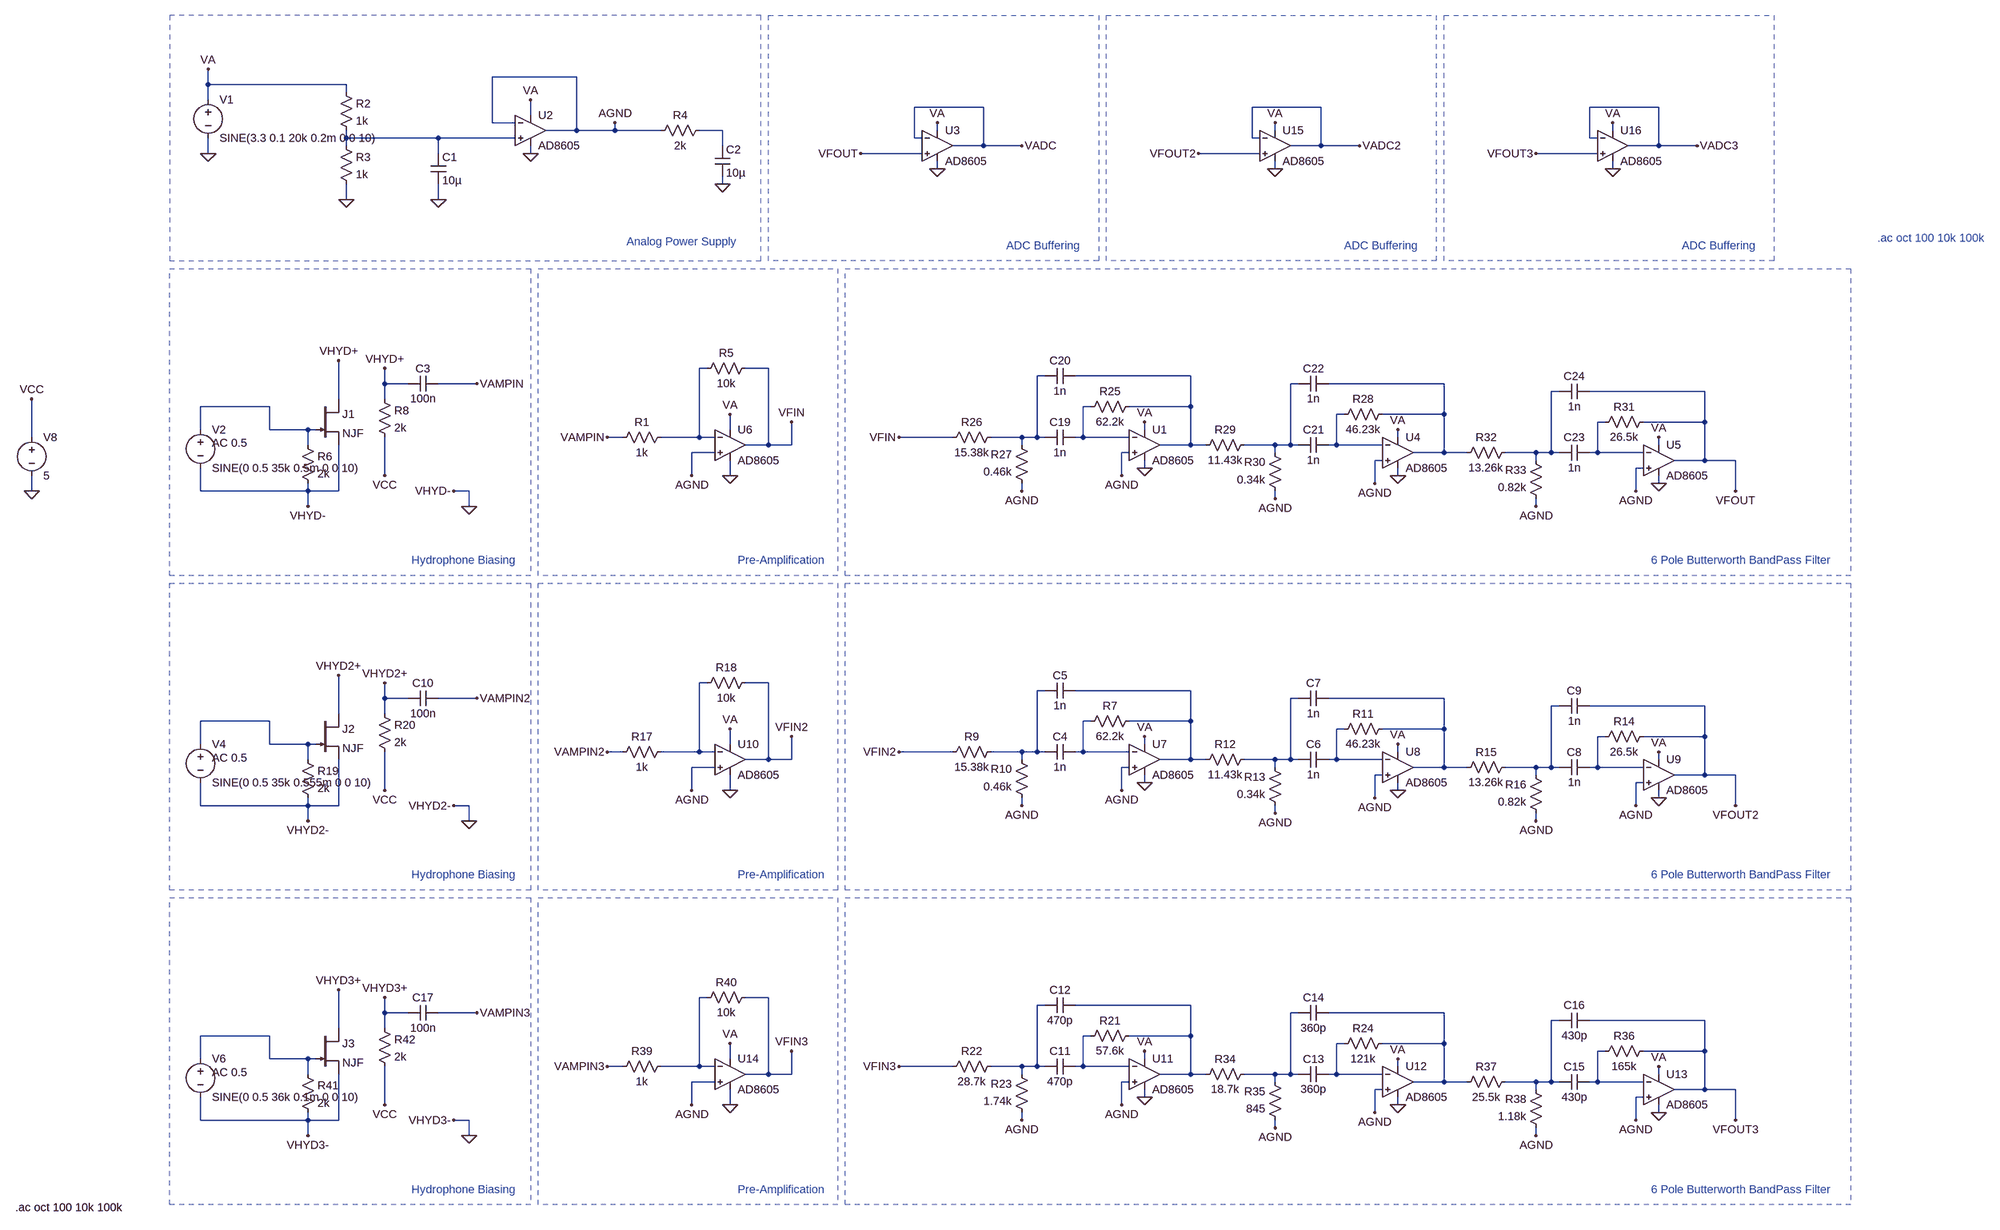
[diagram p0: schematic APB_Filter.asc]
APB_Filter.asc, the LTspice schematic file:
Version 4
SHEET 1 5168 1480
WIRE -528 -896 -704 -896
WIRE -1296 -880 -1296 -912
WIRE -1008 -880 -1296 -880
WIRE -1008 -864 -1008 -880
WIRE -1296 -848 -1296 -880
WIRE 320 -832 176 -832
WIRE 1024 -832 880 -832
WIRE 1728 -832 1584 -832
WIRE -624 -816 -624 -848
WIRE -704 -800 -704 -896
WIRE -656 -800 -704 -800
WIRE -528 -784 -528 -896
WIRE -528 -784 -592 -784
WIRE -448 -784 -448 -800
WIRE -448 -784 -528 -784
WIRE -352 -784 -448 -784
WIRE -224 -784 -272 -784
WIRE 224 -784 224 -800
WIRE 928 -784 928 -800
WIRE 1632 -784 1632 -800
WIRE -1008 -768 -1008 -784
WIRE -816 -768 -1008 -768
WIRE -656 -768 -816 -768
WIRE 176 -768 176 -832
WIRE 192 -768 176 -768
WIRE 880 -768 880 -832
WIRE 896 -768 880 -768
WIRE 1584 -768 1584 -832
WIRE 1600 -768 1584 -768
WIRE -1008 -752 -1008 -768
WIRE -224 -752 -224 -784
WIRE 320 -752 320 -832
WIRE 320 -752 256 -752
WIRE 400 -752 320 -752
WIRE 1024 -752 1024 -832
WIRE 1024 -752 960 -752
WIRE 1104 -752 1024 -752
WIRE 1728 -752 1728 -832
WIRE 1728 -752 1664 -752
WIRE 1808 -752 1728 -752
WIRE -1296 -736 -1296 -768
WIRE -816 -736 -816 -768
WIRE -624 -736 -624 -752
WIRE 192 -736 64 -736
WIRE 896 -736 768 -736
WIRE 1600 -736 1472 -736
WIRE 224 -704 224 -720
WIRE 928 -704 928 -720
WIRE 1632 -704 1632 -720
WIRE -224 -672 -224 -688
WIRE -1008 -640 -1008 -672
WIRE -816 -640 -816 -672
WIRE -256 -288 -272 -288
WIRE -128 -288 -176 -288
WIRE 448 -272 432 -272
WIRE 752 -272 512 -272
WIRE -928 -256 -928 -288
WIRE -880 -256 -928 -256
WIRE -736 -256 -816 -256
WIRE 976 -256 960 -256
WIRE 1280 -256 1040 -256
WIRE 1520 -240 1504 -240
WIRE 1824 -240 1584 -240
WIRE -1024 -224 -1024 -304
WIRE -928 -224 -928 -256
WIRE -1168 -208 -1312 -208
WIRE 544 -208 528 -208
WIRE 752 -208 752 -272
WIRE 752 -208 624 -208
WIRE 1072 -192 1056 -192
WIRE 1280 -192 1280 -256
WIRE 1280 -192 1152 -192
WIRE 1616 -176 1600 -176
WIRE 1824 -176 1824 -240
WIRE 1824 -176 1696 -176
WIRE -1312 -160 -1312 -208
WIRE -1168 -160 -1168 -208
WIRE -1088 -160 -1168 -160
WIRE -1072 -160 -1088 -160
WIRE -208 -160 -208 -192
WIRE 656 -160 656 -176
WIRE -1664 -144 -1664 -224
WIRE -432 -144 -464 -144
WIRE -272 -144 -272 -288
WIRE -272 -144 -352 -144
WIRE -240 -144 -272 -144
WIRE 256 -144 144 -144
WIRE 400 -144 336 -144
WIRE 432 -144 432 -272
WIRE 432 -144 400 -144
WIRE 448 -144 432 -144
WIRE 528 -144 528 -208
WIRE 528 -144 512 -144
WIRE 624 -144 528 -144
WIRE 1184 -144 1184 -160
WIRE -1088 -128 -1088 -160
WIRE -128 -128 -128 -288
WIRE -128 -128 -176 -128
WIRE -80 -128 -80 -176
WIRE -80 -128 -128 -128
WIRE 400 -128 400 -144
WIRE 752 -128 752 -208
WIRE 752 -128 688 -128
WIRE 784 -128 752 -128
WIRE 928 -128 864 -128
WIRE 960 -128 960 -256
WIRE 960 -128 928 -128
WIRE 976 -128 960 -128
WIRE 1056 -128 1056 -192
WIRE 1056 -128 1040 -128
WIRE 1152 -128 1056 -128
WIRE 1728 -128 1728 -144
WIRE -240 -112 -288 -112
WIRE 624 -112 608 -112
WIRE 928 -112 928 -128
WIRE 1280 -112 1280 -192
WIRE 1280 -112 1216 -112
WIRE 1328 -112 1280 -112
WIRE 1472 -112 1408 -112
WIRE 1504 -112 1504 -240
WIRE 1504 -112 1472 -112
WIRE 1520 -112 1504 -112
WIRE 1600 -112 1600 -176
WIRE 1600 -112 1584 -112
WIRE 1696 -112 1600 -112
WIRE 1152 -96 1136 -96
WIRE 1472 -96 1472 -112
WIRE 1824 -96 1824 -176
WIRE 1824 -96 1760 -96
WIRE 1888 -96 1824 -96
WIRE 656 -80 656 -96
WIRE 1696 -80 1680 -80
WIRE -928 -64 -928 -144
WIRE -288 -64 -288 -112
WIRE -208 -64 -208 -96
WIRE 608 -64 608 -112
WIRE 1184 -64 1184 -80
WIRE 1136 -48 1136 -96
WIRE 1728 -48 1728 -64
WIRE -1664 -32 -1664 -64
WIRE -1312 -32 -1312 -80
WIRE -1088 -32 -1088 -48
WIRE -1088 -32 -1312 -32
WIRE -1024 -32 -1024 -128
WIRE -1024 -32 -1088 -32
WIRE -752 -32 -784 -32
WIRE 400 -32 400 -48
WIRE 1680 -32 1680 -80
WIRE 1888 -32 1888 -96
WIRE 928 -16 928 -32
WIRE -1088 0 -1088 -32
WIRE -752 0 -752 -32
WIRE 1472 0 1472 -16
WIRE -256 368 -272 368
WIRE -128 368 -176 368
WIRE 448 384 432 384
WIRE 752 384 512 384
WIRE -928 400 -928 368
WIRE -880 400 -928 400
WIRE -736 400 -816 400
WIRE 976 400 960 400
WIRE 1280 400 1040 400
WIRE 1520 416 1504 416
WIRE 1824 416 1584 416
WIRE -1024 432 -1024 352
WIRE -928 432 -928 400
WIRE -1168 448 -1312 448
WIRE 544 448 528 448
WIRE 752 448 752 384
WIRE 752 448 624 448
WIRE 1072 464 1056 464
WIRE 1280 464 1280 400
WIRE 1280 464 1152 464
WIRE 1616 480 1600 480
WIRE 1824 480 1824 416
WIRE 1824 480 1696 480
WIRE -1312 496 -1312 448
WIRE -1168 496 -1168 448
WIRE -1088 496 -1168 496
WIRE -1072 496 -1088 496
WIRE -208 496 -208 464
WIRE 656 496 656 480
WIRE -432 512 -464 512
WIRE -272 512 -272 368
WIRE -272 512 -352 512
WIRE -240 512 -272 512
WIRE 256 512 144 512
WIRE 400 512 336 512
WIRE 432 512 432 384
WIRE 432 512 400 512
WIRE 448 512 432 512
WIRE 528 512 528 448
WIRE 528 512 512 512
WIRE 624 512 528 512
WIRE 1184 512 1184 496
WIRE -1088 528 -1088 496
WIRE -128 528 -128 368
WIRE -128 528 -176 528
WIRE -80 528 -80 480
WIRE -80 528 -128 528
WIRE 400 528 400 512
WIRE 752 528 752 448
WIRE 752 528 688 528
WIRE 784 528 752 528
WIRE 928 528 864 528
WIRE 960 528 960 400
WIRE 960 528 928 528
WIRE 976 528 960 528
WIRE 1056 528 1056 464
WIRE 1056 528 1040 528
WIRE 1152 528 1056 528
WIRE 1728 528 1728 512
WIRE -240 544 -288 544
WIRE 624 544 608 544
WIRE 928 544 928 528
WIRE 1280 544 1280 464
WIRE 1280 544 1216 544
WIRE 1328 544 1280 544
WIRE 1472 544 1408 544
WIRE 1504 544 1504 416
WIRE 1504 544 1472 544
WIRE 1520 544 1504 544
WIRE 1600 544 1600 480
WIRE 1600 544 1584 544
WIRE 1696 544 1600 544
WIRE 1152 560 1136 560
WIRE 1472 560 1472 544
WIRE 1824 560 1824 480
WIRE 1824 560 1760 560
WIRE 1888 560 1824 560
WIRE 656 576 656 560
WIRE 1696 576 1680 576
WIRE -928 592 -928 512
WIRE -288 592 -288 544
WIRE -208 592 -208 560
WIRE 608 592 608 544
WIRE 1184 592 1184 576
WIRE 1136 608 1136 560
WIRE 1728 608 1728 592
WIRE -1312 624 -1312 576
WIRE -1088 624 -1088 608
WIRE -1088 624 -1312 624
WIRE -1024 624 -1024 528
WIRE -1024 624 -1088 624
WIRE -752 624 -784 624
WIRE 400 624 400 608
WIRE 1680 624 1680 576
WIRE 1888 624 1888 560
WIRE 928 640 928 624
WIRE -1088 656 -1088 624
WIRE -752 656 -752 624
WIRE 1472 656 1472 640
WIRE -256 1024 -272 1024
WIRE -128 1024 -176 1024
WIRE 448 1040 432 1040
WIRE 752 1040 512 1040
WIRE -928 1056 -928 1024
WIRE -880 1056 -928 1056
WIRE -736 1056 -816 1056
WIRE 976 1056 960 1056
WIRE 1280 1056 1040 1056
WIRE 1520 1072 1504 1072
WIRE 1824 1072 1584 1072
WIRE -1024 1088 -1024 1008
WIRE -928 1088 -928 1056
WIRE -1168 1104 -1312 1104
WIRE 544 1104 528 1104
WIRE 752 1104 752 1040
WIRE 752 1104 624 1104
WIRE 1072 1120 1056 1120
WIRE 1280 1120 1280 1056
WIRE 1280 1120 1152 1120
WIRE 1616 1136 1600 1136
WIRE 1824 1136 1824 1072
WIRE 1824 1136 1696 1136
WIRE -1312 1152 -1312 1104
WIRE -1168 1152 -1168 1104
WIRE -1088 1152 -1168 1152
WIRE -1072 1152 -1088 1152
WIRE -208 1152 -208 1120
WIRE 656 1152 656 1136
WIRE -432 1168 -464 1168
WIRE -272 1168 -272 1024
WIRE -272 1168 -352 1168
WIRE -240 1168 -272 1168
WIRE 256 1168 144 1168
WIRE 400 1168 336 1168
WIRE 432 1168 432 1040
WIRE 432 1168 400 1168
WIRE 448 1168 432 1168
WIRE 528 1168 528 1104
WIRE 528 1168 512 1168
WIRE 624 1168 528 1168
WIRE 1184 1168 1184 1152
WIRE -1088 1184 -1088 1152
WIRE -128 1184 -128 1024
WIRE -128 1184 -176 1184
WIRE -80 1184 -80 1136
WIRE -80 1184 -128 1184
WIRE 400 1184 400 1168
WIRE 752 1184 752 1104
WIRE 752 1184 688 1184
WIRE 784 1184 752 1184
WIRE 928 1184 864 1184
WIRE 960 1184 960 1056
WIRE 960 1184 928 1184
WIRE 976 1184 960 1184
WIRE 1056 1184 1056 1120
WIRE 1056 1184 1040 1184
WIRE 1152 1184 1056 1184
WIRE 1728 1184 1728 1168
WIRE -240 1200 -288 1200
WIRE 624 1200 608 1200
WIRE 928 1200 928 1184
WIRE 1280 1200 1280 1120
WIRE 1280 1200 1216 1200
WIRE 1328 1200 1280 1200
WIRE 1472 1200 1408 1200
WIRE 1504 1200 1504 1072
WIRE 1504 1200 1472 1200
WIRE 1520 1200 1504 1200
WIRE 1600 1200 1600 1136
WIRE 1600 1200 1584 1200
WIRE 1696 1200 1600 1200
WIRE 1152 1216 1136 1216
WIRE 1472 1216 1472 1200
WIRE 1824 1216 1824 1136
WIRE 1824 1216 1760 1216
WIRE 1888 1216 1824 1216
WIRE 656 1232 656 1216
WIRE 1696 1232 1680 1232
WIRE -928 1248 -928 1168
WIRE -288 1248 -288 1200
WIRE -208 1248 -208 1216
WIRE 608 1248 608 1200
WIRE 1184 1248 1184 1232
WIRE 1136 1264 1136 1216
WIRE 1728 1264 1728 1248
WIRE -1312 1280 -1312 1232
WIRE -1088 1280 -1088 1264
WIRE -1088 1280 -1312 1280
WIRE -1024 1280 -1024 1184
WIRE -1024 1280 -1088 1280
WIRE -752 1280 -784 1280
WIRE 400 1280 400 1264
WIRE 1680 1280 1680 1232
WIRE 1888 1280 1888 1216
WIRE 928 1296 928 1280
WIRE -1088 1312 -1088 1280
WIRE -752 1312 -752 1280
WIRE 1472 1312 1472 1296
FLAG -1296 -912 VA
FLAG -1008 -640 0
FLAG -448 -800 AGND
FLAG -224 -672 0
FLAG 608 -64 AGND
FLAG 656 -80 0
FLAG 656 -176 VA
FLAG 400 -32 AGND
FLAG 1136 -48 AGND
FLAG 1184 -64 0
FLAG 1184 -160 VA
FLAG 928 -16 AGND
FLAG 1680 -32 AGND
FLAG 1728 -48 0
FLAG 1728 -144 VA
FLAG 1472 0 AGND
FLAG 144 -144 VFIN
FLAG 224 -704 0
FLAG 224 -800 VA
FLAG -208 -192 VA
FLAG -208 -64 0
FLAG -288 -64 AGND
FLAG -464 -144 VAMPIN
FLAG -80 -176 VFIN
FLAG 64 -736 VFOUT
FLAG 400 -752 VADC
FLAG 1888 -32 VFOUT
FLAG -1296 -736 0
FLAG -624 -736 0
FLAG -624 -848 VA
FLAG -816 -640 0
FLAG -1088 0 VHYD-
FLAG -1024 -304 VHYD+
FLAG -752 0 0
FLAG -784 -32 VHYD-
FLAG -928 -288 VHYD+
FLAG -736 -256 VAMPIN
FLAG 608 592 AGND
FLAG 656 576 0
FLAG 656 480 VA
FLAG 400 624 AGND
FLAG 1136 608 AGND
FLAG 1184 592 0
FLAG 1184 496 VA
FLAG 928 640 AGND
FLAG 1680 624 AGND
FLAG 1728 608 0
FLAG 1728 512 VA
FLAG 1472 656 AGND
FLAG 144 512 VFIN2
FLAG -208 464 VA
FLAG -208 592 0
FLAG -288 592 AGND
FLAG -464 512 VAMPIN2
FLAG -80 480 VFIN2
FLAG 1888 624 VFOUT2
FLAG -1088 656 VHYD2-
FLAG -1024 352 VHYD2+
FLAG -752 656 0
FLAG -784 624 VHYD2-
FLAG -928 368 VHYD2+
FLAG -736 400 VAMPIN2
FLAG 608 1248 AGND
FLAG 656 1232 0
FLAG 656 1136 VA
FLAG 400 1280 AGND
FLAG 1136 1264 AGND
FLAG 1184 1248 0
FLAG 1184 1152 VA
FLAG 928 1296 AGND
FLAG 1680 1280 AGND
FLAG 1728 1264 0
FLAG 1728 1168 VA
FLAG 1472 1312 AGND
FLAG 144 1168 VFIN3
FLAG -208 1120 VA
FLAG -208 1248 0
FLAG -288 1248 AGND
FLAG -464 1168 VAMPIN3
FLAG -80 1136 VFIN3
FLAG 1888 1280 VFOUT3
FLAG -1088 1312 VHYD3-
FLAG -1024 1008 VHYD3+
FLAG -752 1312 0
FLAG -784 1280 VHYD3-
FLAG -928 1024 VHYD3+
FLAG -736 1056 VAMPIN3
FLAG -1664 -32 0
FLAG -1664 -224 VCC
FLAG -928 -64 VCC
FLAG -928 592 VCC
FLAG -928 1248 VCC
FLAG 928 -704 0
FLAG 928 -800 VA
FLAG 768 -736 VFOUT2
FLAG 1104 -752 VADC2
FLAG 1632 -704 0
FLAG 1632 -800 VA
FLAG 1472 -736 VFOUT3
FLAG 1808 -752 VADC3
SYMBOL res -1024 -880 R0
SYMATTR InstName R2
SYMATTR Value 1k
SYMBOL res -1024 -768 R0
SYMATTR InstName R3
SYMATTR Value 1k
SYMBOL cap -832 -736 R0
SYMATTR InstName C1
SYMATTR Value 10µ
SYMBOL res -256 -800 R90
WINDOW 0 0 56 VBottom 2
WINDOW 3 32 56 VTop 2
SYMATTR InstName R4
SYMATTR Value 2k
SYMBOL cap -240 -752 R0
SYMATTR InstName C2
SYMATTR Value 10µ
SYMBOL cap 512 -160 R90
WINDOW 0 0 32 VBottom 2
WINDOW 3 32 32 VTop 2
SYMATTR InstName C19
SYMATTR Value 1n
SYMBOL cap 512 -288 R90
WINDOW 0 0 32 VBottom 2
WINDOW 3 32 32 VTop 2
SYMATTR InstName C20
SYMATTR Value 1n
SYMBOL res 640 -224 R90
WINDOW 0 0 56 VBottom 2
WINDOW 3 32 56 VTop 2
SYMATTR InstName R25
SYMATTR Value 62.2k
SYMBOL res 352 -160 R90
WINDOW 0 0 56 VBottom 2
WINDOW 3 32 56 VTop 2
SYMATTR InstName R26
SYMATTR Value 15.38k
SYMBOL res 416 -32 R180
WINDOW 0 36 76 Left 2
WINDOW 3 36 40 Left 2
SYMATTR InstName R27
SYMATTR Value 0.46k
SYMBOL cap 1040 -144 R90
WINDOW 0 0 32 VBottom 2
WINDOW 3 32 32 VTop 2
SYMATTR InstName C21
SYMATTR Value 1n
SYMBOL cap 1040 -272 R90
WINDOW 0 0 32 VBottom 2
WINDOW 3 32 32 VTop 2
SYMATTR InstName C22
SYMATTR Value 1n
SYMBOL res 1168 -208 R90
WINDOW 0 0 56 VBottom 2
WINDOW 3 32 56 VTop 2
SYMATTR InstName R28
SYMATTR Value 46.23k
SYMBOL res 880 -144 R90
WINDOW 0 0 56 VBottom 2
WINDOW 3 32 56 VTop 2
SYMATTR InstName R29
SYMATTR Value 11.43k
SYMBOL res 944 -16 R180
WINDOW 0 36 76 Left 2
WINDOW 3 36 40 Left 2
SYMATTR InstName R30
SYMATTR Value 0.34k
SYMBOL cap 1584 -128 R90
WINDOW 0 0 32 VBottom 2
WINDOW 3 32 32 VTop 2
SYMATTR InstName C23
SYMATTR Value 1n
SYMBOL cap 1584 -256 R90
WINDOW 0 0 32 VBottom 2
WINDOW 3 32 32 VTop 2
SYMATTR InstName C24
SYMATTR Value 1n
SYMBOL res 1712 -192 R90
WINDOW 0 0 56 VBottom 2
WINDOW 3 32 56 VTop 2
SYMATTR InstName R31
SYMATTR Value 26.5k
SYMBOL res 1424 -128 R90
WINDOW 0 0 56 VBottom 2
WINDOW 3 32 56 VTop 2
SYMATTR InstName R32
SYMATTR Value 13.26k
SYMBOL res 1488 0 R180
WINDOW 0 36 76 Left 2
WINDOW 3 36 40 Left 2
SYMATTR InstName R33
SYMATTR Value 0.82k
SYMBOL res -336 -160 R90
WINDOW 0 0 56 VBottom 2
WINDOW 3 32 56 VTop 2
SYMATTR InstName R1
SYMATTR Value 1k
SYMBOL res -160 -304 R90
WINDOW 0 0 56 VBottom 2
WINDOW 3 32 56 VTop 2
SYMATTR InstName R5
SYMATTR Value 10k
SYMBOL voltage -1296 -864 R0
WINDOW 123 0 0 Left 0
WINDOW 39 0 0 Left 0
SYMATTR InstName V1
SYMATTR Value SINE(3.3 0.1 20k 0.2m 0 0 10)
SYMBOL voltage -1312 -176 R0
WINDOW 123 24 44 Left 2
WINDOW 39 0 0 Left 0
SYMATTR Value2 AC 0.5
SYMATTR InstName V2
SYMATTR Value SINE(0 0.5 35k 0.5m 0 0 10)
SYMBOL res -1104 -144 R0
SYMATTR InstName R6
SYMATTR Value 2k
SYMBOL njf -1072 -224 R0
SYMATTR InstName J1
SYMBOL res -944 -240 R0
SYMATTR InstName R8
SYMATTR Value 2k
SYMBOL cap -816 -272 R90
WINDOW 0 0 32 VBottom 2
WINDOW 3 32 32 VTop 2
SYMATTR InstName C3
SYMATTR Value 100n
SYMBOL OpAmps\\AD8605 656 -192 R0
SYMATTR InstName U1
SYMBOL OpAmps\\AD8605 1184 -176 R0
SYMATTR InstName U4
SYMBOL OpAmps\\AD8605 1728 -160 R0
SYMATTR InstName U5
SYMBOL OpAmps\\AD8605 -624 -848 R0
SYMATTR InstName U2
SYMBOL OpAmps\\AD8605 224 -816 R0
SYMATTR InstName U3
SYMBOL OpAmps\\AD8605 -208 -192 R0
SYMATTR InstName U6
SYMBOL cap 512 496 R90
WINDOW 0 0 32 VBottom 2
WINDOW 3 32 32 VTop 2
SYMATTR InstName C4
SYMATTR Value 1n
SYMBOL cap 512 368 R90
WINDOW 0 0 32 VBottom 2
WINDOW 3 32 32 VTop 2
SYMATTR InstName C5
SYMATTR Value 1n
SYMBOL res 640 432 R90
WINDOW 0 0 56 VBottom 2
WINDOW 3 32 56 VTop 2
SYMATTR InstName R7
SYMATTR Value 62.2k
SYMBOL res 352 496 R90
WINDOW 0 0 56 VBottom 2
WINDOW 3 32 56 VTop 2
SYMATTR InstName R9
SYMATTR Value 15.38k
SYMBOL res 416 624 R180
WINDOW 0 36 76 Left 2
WINDOW 3 36 40 Left 2
SYMATTR InstName R10
SYMATTR Value 0.46k
SYMBOL cap 1040 512 R90
WINDOW 0 0 32 VBottom 2
WINDOW 3 32 32 VTop 2
SYMATTR InstName C6
SYMATTR Value 1n
SYMBOL cap 1040 384 R90
WINDOW 0 0 32 VBottom 2
WINDOW 3 32 32 VTop 2
SYMATTR InstName C7
SYMATTR Value 1n
SYMBOL res 1168 448 R90
WINDOW 0 0 56 VBottom 2
WINDOW 3 32 56 VTop 2
SYMATTR InstName R11
SYMATTR Value 46.23k
SYMBOL res 880 512 R90
WINDOW 0 0 56 VBottom 2
WINDOW 3 32 56 VTop 2
SYMATTR InstName R12
SYMATTR Value 11.43k
SYMBOL res 944 640 R180
WINDOW 0 36 76 Left 2
WINDOW 3 36 40 Left 2
SYMATTR InstName R13
SYMATTR Value 0.34k
SYMBOL cap 1584 528 R90
WINDOW 0 0 32 VBottom 2
WINDOW 3 32 32 VTop 2
SYMATTR InstName C8
SYMATTR Value 1n
SYMBOL cap 1584 400 R90
WINDOW 0 0 32 VBottom 2
WINDOW 3 32 32 VTop 2
SYMATTR InstName C9
SYMATTR Value 1n
SYMBOL res 1712 464 R90
WINDOW 0 0 56 VBottom 2
WINDOW 3 32 56 VTop 2
SYMATTR InstName R14
SYMATTR Value 26.5k
SYMBOL res 1424 528 R90
WINDOW 0 0 56 VBottom 2
WINDOW 3 32 56 VTop 2
SYMATTR InstName R15
SYMATTR Value 13.26k
SYMBOL res 1488 656 R180
WINDOW 0 36 76 Left 2
WINDOW 3 36 40 Left 2
SYMATTR InstName R16
SYMATTR Value 0.82k
SYMBOL res -336 496 R90
WINDOW 0 0 56 VBottom 2
WINDOW 3 32 56 VTop 2
SYMATTR InstName R17
SYMATTR Value 1k
SYMBOL res -160 352 R90
WINDOW 0 0 56 VBottom 2
WINDOW 3 32 56 VTop 2
SYMATTR InstName R18
SYMATTR Value 10k
SYMBOL voltage -1312 480 R0
WINDOW 123 24 44 Left 2
WINDOW 39 0 0 Left 0
SYMATTR Value2 AC 0.5
SYMATTR InstName V4
SYMATTR Value SINE(0 0.5 35k 0.555m 0 0 10)
SYMBOL res -1104 512 R0
SYMATTR InstName R19
SYMATTR Value 2k
SYMBOL njf -1072 432 R0
SYMATTR InstName J2
SYMBOL res -944 416 R0
SYMATTR InstName R20
SYMATTR Value 2k
SYMBOL cap -816 384 R90
WINDOW 0 0 32 VBottom 2
WINDOW 3 32 32 VTop 2
SYMATTR InstName C10
SYMATTR Value 100n
SYMBOL OpAmps\\AD8605 656 464 R0
SYMATTR InstName U7
SYMBOL OpAmps\\AD8605 1184 480 R0
SYMATTR InstName U8
SYMBOL OpAmps\\AD8605 1728 496 R0
SYMATTR InstName U9
SYMBOL OpAmps\\AD8605 -208 464 R0
SYMATTR InstName U10
SYMBOL cap 512 1152 R90
WINDOW 0 0 32 VBottom 2
WINDOW 3 32 32 VTop 2
SYMATTR InstName C11
SYMATTR Value 470p
SYMBOL cap 512 1024 R90
WINDOW 0 0 32 VBottom 2
WINDOW 3 32 32 VTop 2
SYMATTR InstName C12
SYMATTR Value 470p
SYMBOL res 640 1088 R90
WINDOW 0 0 56 VBottom 2
WINDOW 3 32 56 VTop 2
SYMATTR InstName R21
SYMATTR Value 57.6k
SYMBOL res 352 1152 R90
WINDOW 0 0 56 VBottom 2
WINDOW 3 32 56 VTop 2
SYMATTR InstName R22
SYMATTR Value 28.7k
SYMBOL res 416 1280 R180
WINDOW 0 36 76 Left 2
WINDOW 3 36 40 Left 2
SYMATTR InstName R23
SYMATTR Value 1.74k
SYMBOL cap 1040 1168 R90
WINDOW 0 0 32 VBottom 2
WINDOW 3 32 32 VTop 2
SYMATTR InstName C13
SYMATTR Value 360p
SYMBOL cap 1040 1040 R90
WINDOW 0 0 32 VBottom 2
WINDOW 3 32 32 VTop 2
SYMATTR InstName C14
SYMATTR Value 360p
SYMBOL res 1168 1104 R90
WINDOW 0 0 56 VBottom 2
WINDOW 3 32 56 VTop 2
SYMATTR InstName R24
SYMATTR Value 121k
SYMBOL res 880 1168 R90
WINDOW 0 0 56 VBottom 2
WINDOW 3 32 56 VTop 2
SYMATTR InstName R34
SYMATTR Value 18.7k
SYMBOL res 944 1296 R180
WINDOW 0 36 76 Left 2
WINDOW 3 36 40 Left 2
SYMATTR InstName R35
SYMATTR Value 845
SYMBOL cap 1584 1184 R90
WINDOW 0 0 32 VBottom 2
WINDOW 3 32 32 VTop 2
SYMATTR InstName C15
SYMATTR Value 430p
SYMBOL cap 1584 1056 R90
WINDOW 0 0 32 VBottom 2
WINDOW 3 32 32 VTop 2
SYMATTR InstName C16
SYMATTR Value 430p
SYMBOL res 1712 1120 R90
WINDOW 0 0 56 VBottom 2
WINDOW 3 32 56 VTop 2
SYMATTR InstName R36
SYMATTR Value 165k
SYMBOL res 1424 1184 R90
WINDOW 0 0 56 VBottom 2
WINDOW 3 32 56 VTop 2
SYMATTR InstName R37
SYMATTR Value 25.5k
SYMBOL res 1488 1312 R180
WINDOW 0 36 76 Left 2
WINDOW 3 36 40 Left 2
SYMATTR InstName R38
SYMATTR Value 1.18k
SYMBOL res -336 1152 R90
WINDOW 0 0 56 VBottom 2
WINDOW 3 32 56 VTop 2
SYMATTR InstName R39
SYMATTR Value 1k
SYMBOL res -160 1008 R90
WINDOW 0 0 56 VBottom 2
WINDOW 3 32 56 VTop 2
SYMATTR InstName R40
SYMATTR Value 10k
SYMBOL voltage -1312 1136 R0
WINDOW 123 24 44 Left 2
WINDOW 39 0 0 Left 0
SYMATTR Value2 AC 0.5
SYMATTR InstName V6
SYMATTR Value SINE(0 0.5 36k 0.1m 0 0 10)
SYMBOL res -1104 1168 R0
SYMATTR InstName R41
SYMATTR Value 2k
SYMBOL njf -1072 1088 R0
SYMATTR InstName J3
SYMBOL res -944 1072 R0
SYMATTR InstName R42
SYMATTR Value 2k
SYMBOL cap -816 1040 R90
WINDOW 0 0 32 VBottom 2
WINDOW 3 32 32 VTop 2
SYMATTR InstName C17
SYMATTR Value 100n
SYMBOL OpAmps\\AD8605 656 1120 R0
SYMATTR InstName U11
SYMBOL OpAmps\\AD8605 1184 1136 R0
SYMATTR InstName U12
SYMBOL OpAmps\\AD8605 1728 1152 R0
SYMATTR InstName U13
SYMBOL OpAmps\\AD8605 -208 1120 R0
SYMATTR InstName U14
SYMBOL voltage -1664 -160 R0
WINDOW 123 0 0 Left 0
WINDOW 39 0 0 Left 0
SYMATTR InstName V8
SYMATTR Value 5
SYMBOL OpAmps\\AD8605 928 -816 R0
SYMATTR InstName U15
SYMBOL OpAmps\\AD8605 1632 -816 R0
SYMATTR InstName U16
TEXT 2184 -560 Left 2 ;.ac oct 100 10k 100k
TEXT -872 112 Left 2 ;Hydrophone Biasing
TEXT -424 -552 Left 2 ;Analog Power Supply
TEXT -192 112 Left 2 ;Pre-Amplification
TEXT 1712 112 Left 2 ;6 Pole Butterworth BandPass Filter
TEXT 368 -544 Left 2 ;ADC Buffering
TEXT -872 768 Left 2 ;Hydrophone Biasing
TEXT -192 768 Left 2 ;Pre-Amplification
TEXT 1712 768 Left 2 ;6 Pole Butterworth BandPass Filter
TEXT -872 1424 Left 2 ;Hydrophone Biasing
TEXT -192 1424 Left 2 ;Pre-Amplification
TEXT 1712 1424 Left 2 ;6 Pole Butterworth BandPass Filter
TEXT 1072 -544 Left 2 ;ADC Buffering
TEXT 1776 -544 Left 2 ;ADC Buffering
TEXT -1698 1462 Left 2 !.ac oct 100 10k 100k
RECTANGLE Normal -624 144 -1376 -496 2
RECTANGLE Normal -144 -1024 -1376 -512 2
RECTANGLE Normal 16 144 -608 -496 2
RECTANGLE Normal 2128 144 32 -496 2
RECTANGLE Normal 560 -512 -128 -1024 2
RECTANGLE Normal -624 800 -1376 160 2
RECTANGLE Normal 16 800 -608 160 2
RECTANGLE Normal 2128 800 32 160 2
RECTANGLE Normal -624 1456 -1376 816 2
RECTANGLE Normal 16 1456 -608 816 2
RECTANGLE Normal 2128 1456 32 816 2
RECTANGLE Normal 1264 -512 576 -1024 2
RECTANGLE Normal 1968 -512 1280 -1024 2

The netlist it stands for:
* APB_Filter.asc
R2 VA N002 1k
R3 N002 0 1k
C1 N002 0 10µ
R4 N001 AGND 2k
C2 N001 0 10µ
C19 N010 N004 1n
C20 N005 N004 1n
R25 N005 N010 62.2k
R26 N004 VFIN 15.38k
R27 AGND N004 0.46k
C21 N011 N006 1n
C22 N007 N006 1n
R28 N007 N011 46.23k
R29 N006 N005 11.43k
R30 AGND N006 0.34k
C23 N012 N008 1n
C24 VFOUT N008 1n
R31 VFOUT N012 26.5k
R32 N008 N007 13.26k
R33 AGND N008 0.82k
R1 N003 VAMPIN 1k
R5 VFIN N003 10k
V1 VA 0 SINE(3.3 0.1 20k 0.2m 0 0 10)
V2 N009 0 SINE(0 0.5 35k 0.5m 0 0 10) AC 0.5
R6 N009 0 2k
J1 VHYD+ N009 0 NJF
R8 VHYD+ VCC 2k
C3 VAMPIN VHYD+ 100n
XU1 AGND N010 VA 0 N005 AD8605  ; pins In+ In- V+ V- OUT
XU4 AGND N011 VA 0 N007 AD8605  ; pins In+ In- V+ V- OUT
XU5 AGND N012 VA 0 VFOUT AD8605  ; pins In+ In- V+ V- OUT
XU2 N002 AGND VA 0 AGND AD8605  ; pins In+ In- V+ V- OUT
XU3 VFOUT VADC VA 0 VADC AD8605  ; pins In+ In- V+ V- OUT
XU6 AGND N003 VA 0 VFIN AD8605  ; pins In+ In- V+ V- OUT
C4 N020 N014 1n
C5 N015 N014 1n
R7 N015 N020 62.2k
R9 N014 VFIN2 15.38k
R10 AGND N014 0.46k
C6 N021 N016 1n
C7 N017 N016 1n
R11 N017 N021 46.23k
R12 N016 N015 11.43k
R13 AGND N016 0.34k
C8 N022 N018 1n
C9 VFOUT2 N018 1n
R14 VFOUT2 N022 26.5k
R15 N018 N017 13.26k
R16 AGND N018 0.82k
R17 N013 VAMPIN2 1k
R18 VFIN2 N013 10k
V4 N019 0 SINE(0 0.5 35k 0.555m 0 0 10) AC 0.5
R19 N019 0 2k
J2 VHYD2+ N019 0 NJF
R20 VHYD2+ VCC 2k
C10 VAMPIN2 VHYD2+ 100n
XU7 AGND N020 VA 0 N015 AD8605  ; pins In+ In- V+ V- OUT
XU8 AGND N021 VA 0 N017 AD8605  ; pins In+ In- V+ V- OUT
XU9 AGND N022 VA 0 VFOUT2 AD8605  ; pins In+ In- V+ V- OUT
XU10 AGND N013 VA 0 VFIN2 AD8605  ; pins In+ In- V+ V- OUT
C11 N030 N024 470p
C12 N025 N024 470p
R21 N025 N030 57.6k
R22 N024 VFIN3 28.7k
R23 AGND N024 1.74k
C13 N031 N026 360p
C14 N027 N026 360p
R24 N027 N031 121k
R34 N026 N025 18.7k
R35 AGND N026 845
C15 N032 N028 430p
C16 VFOUT3 N028 430p
R36 VFOUT3 N032 165k
R37 N028 N027 25.5k
R38 AGND N028 1.18k
R39 N023 VAMPIN3 1k
R40 VFIN3 N023 10k
V6 N029 0 SINE(0 0.5 36k 0.1m 0 0 10) AC 0.5
R41 N029 0 2k
J3 VHYD3+ N029 0 NJF
R42 VHYD3+ VCC 2k
C17 VAMPIN3 VHYD3+ 100n
XU11 AGND N030 VA 0 N025 AD8605  ; pins In+ In- V+ V- OUT
XU12 AGND N031 VA 0 N027 AD8605  ; pins In+ In- V+ V- OUT
XU13 AGND N032 VA 0 VFOUT3 AD8605  ; pins In+ In- V+ V- OUT
XU14 AGND N023 VA 0 VFIN3 AD8605  ; pins In+ In- V+ V- OUT
V8 VCC 0 5
XU15 VFOUT2 VADC2 VA 0 VADC2 AD8605  ; pins In+ In- V+ V- OUT
XU16 VFOUT3 VADC3 VA 0 VADC3 AD8605  ; pins In+ In- V+ V- OUT
.model NJF NJF
.model PJF PJF
.lib standard.jft
* .ac oct 100 10k 100k
* Hydrophone Biasing
* Analog Power Supply
* Pre-Amplification
* 6 Pole Butterworth BandPass Filter
* ADC Buffering
* Hydrophone Biasing
* Pre-Amplification
* 6 Pole Butterworth BandPass Filter
* Hydrophone Biasing
* Pre-Amplification
* 6 Pole Butterworth BandPass Filter
* ADC Buffering
* ADC Buffering
.ac oct 100 10k 100k
.lib ADI.lib
.backanno
.end